# Altium schematic sheet TIDA-00641_Hardware.SchDoc
size 431 x 279 mm; Date: Not shown in title block; ApprovedBy: Not shown in title block; CheckedBy: Not shown in title block; Author: Not shown in title block; CompanyName: Not shown in title block; Engineer: Not shown in title block; Organization: Not shown in title block; Address1: Not shown in title block; Address2: Not shown in title block; Address3: Not shown in title block; Address4: Not shown in title block; DocumentNumber: 1; Revision: Use project parameter SCH_Rev; SheetNumber: 3; SheetTotal: 3; PageSetup: Record=PageOptions|CenterHorizontal=True|CenterVertical=True|PrintScale=1.00|XCorrection=1.00|YCorrection=1.00|PrintKind=0|BorderSize=5000000|LeftOffset=0|BottomOffset=0|Orientation=2|PaperLength=1000|PaperWidth=1000|Scale=100|PaperSource=15|PrintQuality=600|MediaType=1|DitherType=10|PaperKind=Letter|PrintScaleMode=1; CurrentTime: Not shown in title block; CurrentDate: Not shown in title block; Time: Not shown in title block; DocumentFullPathAndName: Not shown in title block; DocumentName: Not shown in title block; ModifiedDate: Not shown in title block; ImagePath: Not shown in title block
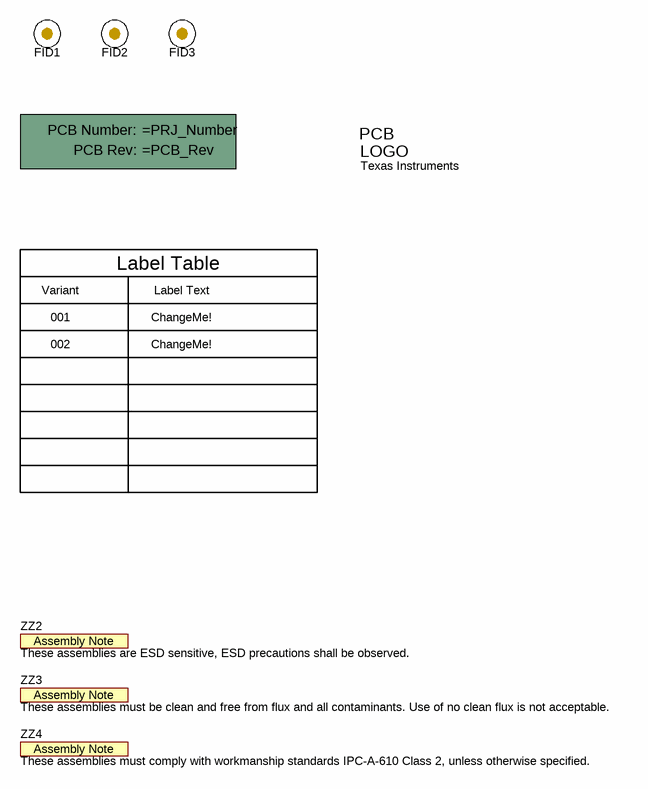
[diagram p0: TIDA-00641_Hardware.SchDoc]

## Parts
!PCB  Printed Circuit Board  (value not drawn)  (mechanical)
FID1  Fiducial  [Fiducial10-20]  (value not drawn)
FID2  Fiducial  [Fiducial10-20]  (value not drawn)
FID3  Fiducial  [Fiducial10-20]  (value not drawn)
Logo1  Texas Instruments  [TI_Stacked_Overlay_Small]  (no BOM)
ZZ2  These assemblies are ESD sensitive, ESD precautions shall be observed.  [AssemblyNote]  (no BOM)
ZZ3  These assemblies must be clean and free from flux and all contaminants. Use of no clean flux is not acceptable.  [AssemblyNote]  (no BOM)
ZZ4  These assemblies must comply with workmanship standards IPC-A-610 Class 2, unless otherwise specified.  [AssemblyNote]  (no BOM)

## Notes on the sheet
- Variant
- Label Table
- Label Text
- 001
- 002
- ChangeMe!
- Drawn By:
- SVN Rev:
- Number:
- TID #:
- Orderable:
- Rev:
- Sheet Title:
- File:
- Project Title:
- Designed for:
- Assembly Variant:
- Mod. Date:
- Sheet:
- Size:
- of
- B
- http://www.ti.com
- Texas Instruments and/or its licensors do not warrant the accuracy or completeness of this specification or any information contained therein. Texas Instruments and/or its licensors do not warrant that this design will meet the specifications, will be suitable for your application or fit for any particular purpose, or will operate in an implementation. Texas Instruments and/or its licensors do not warrant that the design is production worthy. You should completely validate and test your design implementation to confirm the system functionality for your application.
- Engineer:
- Contact:
- © Texas Instruments
- (in symbol AssemblyNote) Assembly Note
- (in symbol PCB) PCB Number:; PCB Rev:
- (in symbol TI_Logo) PCB; LOGO

## Library data of the parts
!PCB = PCB: Manufacturer: Any; SymbolCreator: a0412235; SymbolVersion: 2012-05-30; CompType: PCB; PartNumber: =PRJ_Number; RoHS: O; MountType: N/A; Publisher: Texas Instruments; LatestRevisionDate: 2012-06-27; LatestRevisionNote: Initial Version; Alternate Manufacturer: -; Alternate PartNumber: -
FID1-FID3 = Fiducial: Fiducial mark.  There is nothing to buy or mount.; SymbolCreator: codlsc; SymbolVersion: 2009-11-4; CompType: Fiducial; Publisher: Texas Instruments; LatestRevisionDate: 2014-08-01; LatestRevisionNote: Added Alternate PartNumber and Alternate Manufacturer parameters to appropriate components.; Manufacturer: N/A; MountType: N/A; PackageReference: Fiducial; PartNumber: N/A; ClassName: FiducialMark
Logo1 = TI_Logo: Texas Instrument Corporate Signature; SymbolCreator: codlsc; SymbolVersion: 2011-08-22; Published: 2009-03-03; Publisher: National Semiconductor; ClassName: Logo; LatestRevisionDate: 2011-10-25; LatestRevisionNote: Added ClassName of Logo.
ZZ2-ZZ4 = AssemblyNote: SymbolCreator: codlsc; SymbolVersion: 2010-05-18; CompType: AssemblyNote; ClassName: AssemblyNote; Publisher: Texas Instruments; LatestRevisionDate: 2012-06-14; LatestRevisionNote: Initial Version; Alternate Manufacturer: -; Alternate PartNumber: -